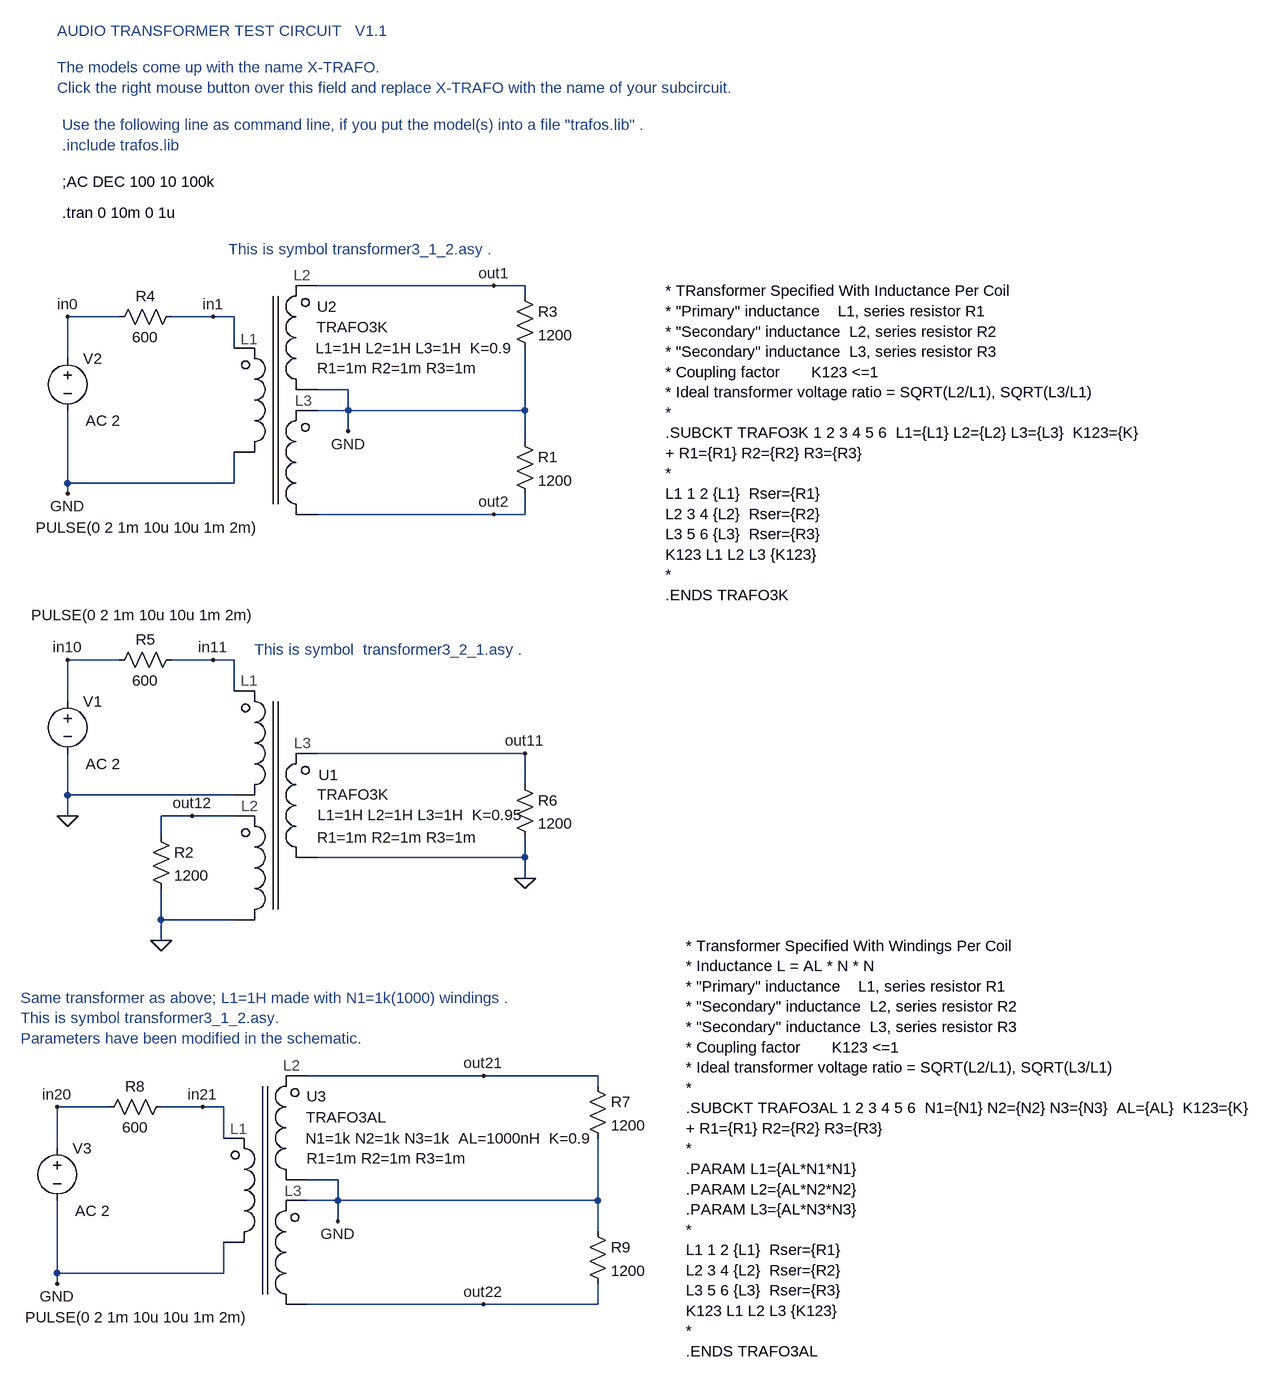
[diagram p0: schematic trafo_test_3coils.asc]
trafo_test_3coils.asc, the LTspice schematic file:
Version 4
SHEET 1 2888 2316
WIRE 928 608 928 672
WIRE 928 752 928 864
WIRE 1008 608 928 608
WIRE 1088 608 1152 608
WIRE 928 864 928 880
WIRE 1184 656 1184 608
WIRE 1184 608 1152 608
WIRE 1184 816 1184 864
WIRE 1184 864 928 864
WIRE 1312 752 1360 752
WIRE 1360 752 1360 784
WIRE 1360 752 1360 720
WIRE 1360 720 1312 720
WIRE 1312 560 1584 560
WIRE 1312 912 1584 912
WIRE 1632 800 1632 752
WIRE 1632 752 1360 752
WIRE 1632 752 1632 656
WIRE 1632 576 1632 560
WIRE 1632 880 1632 912
WIRE 928 1136 928 1200
WIRE 928 1280 928 1344
WIRE 1008 1136 928 1136
WIRE 1088 1136 1152 1136
WIRE 1184 1184 1184 1136
WIRE 1184 1136 1152 1136
WIRE 1184 1344 928 1344
WIRE 1312 1280 1632 1280
WIRE 1312 1440 1632 1440
WIRE 1632 1328 1632 1280
WIRE 1072 1568 1072 1536
WIRE 1072 1408 1072 1376
WIRE 1632 1408 1632 1440
WIRE 928 1376 928 1344
WIRE 1184 1376 1120 1376
WIRE 1184 1536 1072 1536
WIRE 1072 1536 1072 1488
WIRE 1632 1472 1632 1440
WIRE 1584 912 1632 912
WIRE 1584 560 1632 560
WIRE 1120 1376 1072 1376
WIRE 912 1824 912 1888
WIRE 912 1968 912 2080
WIRE 992 1824 912 1824
WIRE 1072 1824 1136 1824
WIRE 912 2080 912 2096
WIRE 1168 1872 1168 1824
WIRE 1168 1824 1136 1824
WIRE 1168 2032 1168 2080
WIRE 1168 2080 912 2080
WIRE 1296 1968 1344 1968
WIRE 1344 1968 1344 2000
WIRE 1344 1968 1344 1936
WIRE 1344 1936 1296 1936
WIRE 1296 1776 1568 1776
WIRE 1296 2128 1568 2128
WIRE 1744 2016 1744 1968
WIRE 1744 1968 1344 1968
WIRE 1744 1968 1744 1872
WIRE 1744 1792 1744 1776
WIRE 1744 2096 1744 2128
WIRE 1568 2128 1744 2128
WIRE 1568 1776 1744 1776
FLAG 928 880 GND
FLAG 928 608 in0
FLAG 1360 784 GND
FLAG 1152 608 in1
FLAG 1584 560 out1
FLAG 1584 912 out2
FLAG 928 1136 in10
FLAG 1152 1136 in11
FLAG 928 1376 0
FLAG 1072 1568 0
FLAG 1632 1472 0
FLAG 1632 1280 out11
FLAG 1120 1376 out12
FLAG 912 2096 GND
FLAG 912 1824 in20
FLAG 1344 2000 GND
FLAG 1136 1824 in21
FLAG 1568 1776 out21
FLAG 1568 2128 out22
SYMBOL res 1616 560 R0
SYMATTR InstName R3
SYMATTR Value 1200
SYMBOL res 992 624 R270
WINDOW 0 32 56 VTop 0
WINDOW 3 0 56 VBottom 0
SYMATTR InstName R4
SYMATTR Value 600
SYMBOL VOLTAGE 928 656 R0
WINDOW 39 0 0 Left 0
WINDOW 123 28 112 Left 0
WINDOW 3 -49 276 Left 0
SYMATTR Value2 AC 2
SYMATTR Value PULSE(0 2 1m 10u 10u 1m 2m)
SYMATTR InstName V2
SYMBOL res 1616 784 R0
SYMATTR InstName R1
SYMATTR Value 1200
SYMBOL Private\\transformer3_1_2 1168 560 R0
SYMATTR InstName U2
SYMATTR Value TRAFO3K
SYMATTR SpiceLine L1=1H L2=1H L3=1H  K=0.9
SYMBOL Private\\transformer3_2_1 1168 1184 R0
SYMATTR InstName U1
SYMATTR Value TRAFO3K
SYMATTR SpiceLine L1=1H L2=1H L3=1H  K=0.95
SYMBOL res 1056 1392 R0
SYMATTR InstName R2
SYMATTR Value 1200
SYMBOL res 992 1152 R270
WINDOW 0 32 56 VTop 0
WINDOW 3 0 56 VBottom 0
SYMATTR InstName R5
SYMATTR Value 600
SYMBOL VOLTAGE 928 1184 R0
WINDOW 39 0 0 Left 0
WINDOW 123 28 112 Left 0
WINDOW 3 -56 -117 Left 0
SYMATTR Value2 AC 2
SYMATTR Value PULSE(0 2 1m 10u 10u 1m 2m)
SYMATTR InstName V1
SYMBOL res 1616 1312 R0
SYMATTR InstName R6
SYMATTR Value 1200
SYMBOL res 1728 1776 R0
SYMATTR InstName R7
SYMATTR Value 1200
SYMBOL res 976 1840 R270
WINDOW 0 32 56 VTop 0
WINDOW 3 0 56 VBottom 0
SYMATTR InstName R8
SYMATTR Value 600
SYMBOL VOLTAGE 912 1872 R0
WINDOW 39 0 0 Left 0
WINDOW 123 28 112 Left 0
WINDOW 3 -49 276 Left 0
SYMATTR Value2 AC 2
SYMATTR Value PULSE(0 2 1m 10u 10u 1m 2m)
SYMATTR InstName V3
SYMBOL res 1728 2000 R0
SYMATTR InstName R9
SYMATTR Value 1200
SYMBOL Private\\transformer3_1_2 1152 1776 R0
SYMATTR InstName U3
SYMATTR Value TRAFO3AL
SYMATTR SpiceLine N1=1k N2=1k N3=1k  AL=1000nH  K=0.9
TEXT 920 400 Left 0 !;AC DEC 100 10 100k
TEXT 920 344 Left 0 ;.include trafos.lib
TEXT 920 448 Left 0 !.tran 0 10m 0 1u
TEXT 912 168 Left 0 ;AUDIO TRANSFORMER TEST CIRCUIT   V1.1
TEXT 1848 568 Left 0 !* TRansformer Specified With Inductance Per Coil\n* "Primary" inductance    L1, series resistor R1\n* "Secondary" inductance  L2, series resistor R2\n* "Secondary" inductance  L3, series resistor R3\n* Coupling factor       K123 <=1\n* Ideal transformer voltage ratio = SQRT(L2/L1), SQRT(L3/L1)\n*\n.SUBCKT TRAFO3K 1 2 3 4 5 6  L1={L1} L2={L2} L3={L3}  K123={K}\n+ R1={R1} R2={R2} R3={R3}\n*\nL1 1 2 {L1}  Rser={R1}\nL2 3 4 {L2}  Rser={R2}\nL3 5 6 {L3}  Rser={R3}\nK123 L1 L2 L3 {K123}\n*\n.ENDS TRAFO3K
TEXT 1176 504 Left 0 ;This is symbol transformer3_1_2.asy .
TEXT 1216 1120 Left 0 ;This is symbol  transformer3_2_1.asy .
TEXT 1880 1576 Left 0 !* Transformer Specified With Windings Per Coil\n* Inductance L = AL * N * N\n* "Primary" inductance    L1, series resistor R1\n* "Secondary" inductance  L2, series resistor R2\n* "Secondary" inductance  L3, series resistor R3\n* Coupling factor       K123 <=1\n* Ideal transformer voltage ratio = SQRT(L2/L1), SQRT(L3/L1)\n*\n.SUBCKT TRAFO3AL 1 2 3 4 5 6  N1={N1} N2={N2} N3={N3}  AL={AL}  K123={K}\n+ R1={R1} R2={R2} R3={R3}\n*\n.PARAM L1={AL*N1*N1}\n.PARAM L2={AL*N2*N2}\n.PARAM L3={AL*N3*N3}\n*\nL1 1 2 {L1}  Rser={R1}\nL2 3 4 {L2}  Rser={R2}\nL3 5 6 {L3}  Rser={R3}\nK123 L1 L2 L3 {K123}\n*\n.ENDS TRAFO3AL
TEXT 856 1656 Left 0 ;Same transformer as above; L1=1H made with N1=1k(1000) windings .\nThis is symbol transformer3_1_2.asy.\nParameters have been modified in the schematic.
TEXT 920 312 Left 0 ;Use the following line as command line, if you put the model(s) into a file "trafos.lib" .
TEXT 912 224 Left 0 ;The models come up with the name X-TRAFO.\nClick the right mouse button over this field and replace X-TRAFO with the name of your subcircuit.

The netlist it stands for:
* trafo_test_3coils.asc
R3 out1 GND 1200
R4 in0 in1 600
V2 in0 GND PULSE(0 2 1m 10u 10u 1m 2m) AC 2
R1 GND out2 1200
XU2 in1 GND out1 GND GND out2 TRAFO3K L1=1H L2=1H L3=1H  K=0.9 R1=1m R2=1m R3=1m  ; pins A B C D E F
XU1 in11 0 out12 0 out11 0 TRAFO3K L1=1H L2=1H L3=1H  K=0.95 R1=1m R2=1m R3=1m  ; pins A B C D E F
R2 out12 0 1200
R5 in10 in11 600
V1 in10 0 PULSE(0 2 1m 10u 10u 1m 2m) AC 2
R6 out11 0 1200
R7 out21 GND 1200
R8 in20 in21 600
V3 in20 GND PULSE(0 2 1m 10u 10u 1m 2m) AC 2
R9 GND out22 1200
XU3 in21 GND out21 GND GND out22 TRAFO3AL N1=1k N2=1k N3=1k  AL=1000nH  K=0.9 R1=1m R2=1m R3=1m  ; pins A B C D E F
;AC DEC 100 10 100k
* .include trafos.lib
.tran 0 10m 0 1u
* AUDIO TRANSFORMER TEST CIRCUIT   V1.1
* TRansformer Specified With Inductance Per Coil
* "Primary" inductance    L1, series resistor R1
* "Secondary" inductance  L2, series resistor R2
* "Secondary" inductance  L3, series resistor R3
* Coupling factor       K123 <=1
* Ideal transformer voltage ratio = SQRT(L2/L1), SQRT(L3/L1)
*
.SUBCKT TRAFO3K 1 2 3 4 5 6  L1={L1} L2={L2} L3={L3}  K123={K}
+ R1={R1} R2={R2} R3={R3}
*
L1 1 2 {L1}  Rser={R1}
L2 3 4 {L2}  Rser={R2}
L3 5 6 {L3}  Rser={R3}
K123 L1 L2 L3 {K123}
*
.ENDS TRAFO3K
* This is symbol transformer3_1_2.asy .
* This is symbol  transformer3_2_1.asy .
* Transformer Specified With Windings Per Coil
* Inductance L = AL * N * N
* "Primary" inductance    L1, series resistor R1
* "Secondary" inductance  L2, series resistor R2
* "Secondary" inductance  L3, series resistor R3
* Coupling factor       K123 <=1
* Ideal transformer voltage ratio = SQRT(L2/L1), SQRT(L3/L1)
*
.SUBCKT TRAFO3AL 1 2 3 4 5 6  N1={N1} N2={N2} N3={N3}  AL={AL}  K123={K}
+ R1={R1} R2={R2} R3={R3}
*
.PARAM L1={AL*N1*N1}
.PARAM L2={AL*N2*N2}
.PARAM L3={AL*N3*N3}
*
L1 1 2 {L1}  Rser={R1}
L2 3 4 {L2}  Rser={R2}
L3 5 6 {L3}  Rser={R3}
K123 L1 L2 L3 {K123}
*
.ENDS TRAFO3AL
* Same transformer as above; L1=1H made with N1=1k(1000) windings .
* This is symbol transformer3_1_2.asy.
* Parameters have been modified in the schematic.
* Use the following line as command line, if you put the model(s) into a file "trafos.lib" .
* The models come up with the name X-TRAFO.
* Click the right mouse button over this field and replace X-TRAFO with the name of your subcircuit.
.backanno
.end